# Altium project US_SB_HW.PrjPcb
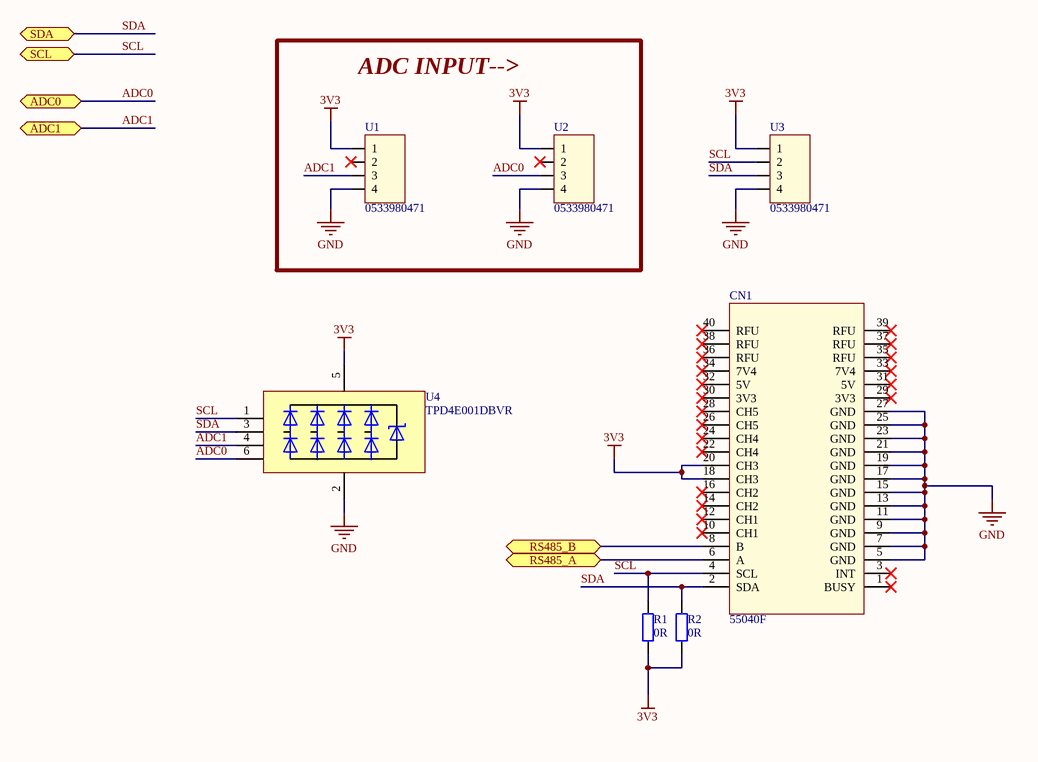
[diagram p0: US_SB_BIC.SchDoc]
hwver: v0.2
9 sheets, 131 parts. Net scope: hierarchical (ports join the sheet entries above them; power ports are global).
Board file: US_SB_GHW.PcbDoc
Sheets:
  US_SB_BIC.SchDoc
  US_SB_GC.SchDoc
  US_SB_GHW.SchDoc
  US_SB_MCU.SchDoc
  US_SB_Meteo.SchDoc
  US_SB_Orinet.SchDoc
  US_SB_OS.SchDoc
  US_SB_RS485.SchDoc
  US_SB_USB.SchDoc

## Sheet US_SB_BIC.SchDoc
size A4

### Parts
CN1  55040F  [HEADER_40PIN_12MM2]
R1  0R  [R0603_IPC_MD]  (no BOM)
R2  0R  [R0603_IPC_MD]  (no BOM)
U1  0533980471  [PB_53261-0471_Right]
U2  0533980471  [PB_53261-0471_Right]
U3  0533980471  [PB_53261-0471_Right]
U4  TPD4E001DBVR  [SOT23-6]

### Blocks framed on the sheet
ADC INPUT-->: U1 U2

### Ports
ADC0, ADC1, RS485_A (bidir), RS485_B (bidir), SCL, SDA

### Nets
3V3: CN1.18(CH3) CN1.20(CH3) R1.1 R2.1 U1.1 U2.1 U3.1 U4.5(VCC)
GND: CN1.5(GND) CN1.7(GND) CN1.9(GND) CN1.11(GND) CN1.13(GND) CN1.15(GND) CN1.17(GND) CN1.19(GND) CN1.21(GND) CN1.23(GND) CN1.25(GND) CN1.27(GND) U1.4 U2.4 U3.4 U4.2(GND)
ADC0: U2.3 U4.6(IO4) ; port ADC0
ADC1: U1.3 U4.4(IO3) ; port ADC1
SCL: CN1.4(SCL) R1.2 U3.2 U4.1(IO1) ; port SCL
SDA: CN1.2(SDA) R2.2 U3.3 U4.3(IO2) ; port SDA
NetCN1_6: CN1.6(A) ; port RS485_A
NetCN1_8: CN1.8(B) ; port RS485_B

Not connected (* = marked no-connect by the designer): CN1 1(BUSY)* 3(INT)* 10(CH1)* 12(CH1)* 14(CH2)* 16(CH2)* 22(CH4)* 24(CH4)* 26(CH5)* 28(CH5)* 29(3V3)* 30(3V3)* 31(5V)* 32(5V)* 33(7V4)* 34(7V4)* 35(RFU)* 36(RFU)* 37(RFU)* 38(RFU)* 39(RFU)* 40(RFU)*; U1 2*; U2 2*

### Library data of the parts
CN1 = ALFASAT_BIC: CONN HEADER R/A 40POS 2.54MM; Manufacturer: On Shore Technology Inc.; Manufacturer Part Number: 55040F; Supplier 1: LCSC; Supplier Part Number 1: C35165
R1 R2 = CR0603-J/-000ELF: RES SMD 0 OHM JUMPER 1/10W 0603; Manufacturer: Bourns Inc.; Tolarance: 1%; Value: 0R; Manufacturer Part Number: CR0603-J/-000ELF; Supplier 1: Digi-Key; Supplier Part Number 1: CR0603-J/-000ELFCT-ND
U1-U3 = PB_053398_0471: Connector Header Surface Mount 4 position 0.049" (1.25mm); Manufacturer: Molex; Manufacturer Part Number: 0533980471; Supplier 1: Digi-Key; Supplier Part Number 1: WM7608TR-ND
U4 = TPD4E001DBVR: 4x TVS DIODE 5.5V SOT23-6; Manufacturer: TI; Manufacturer Part Number: TPD4E001DBVR; Supplier 1: Digi-Key; Supplier Part Number 1: 296-28203-1-ND

## Sheet US_SB_GC.SchDoc
size A4
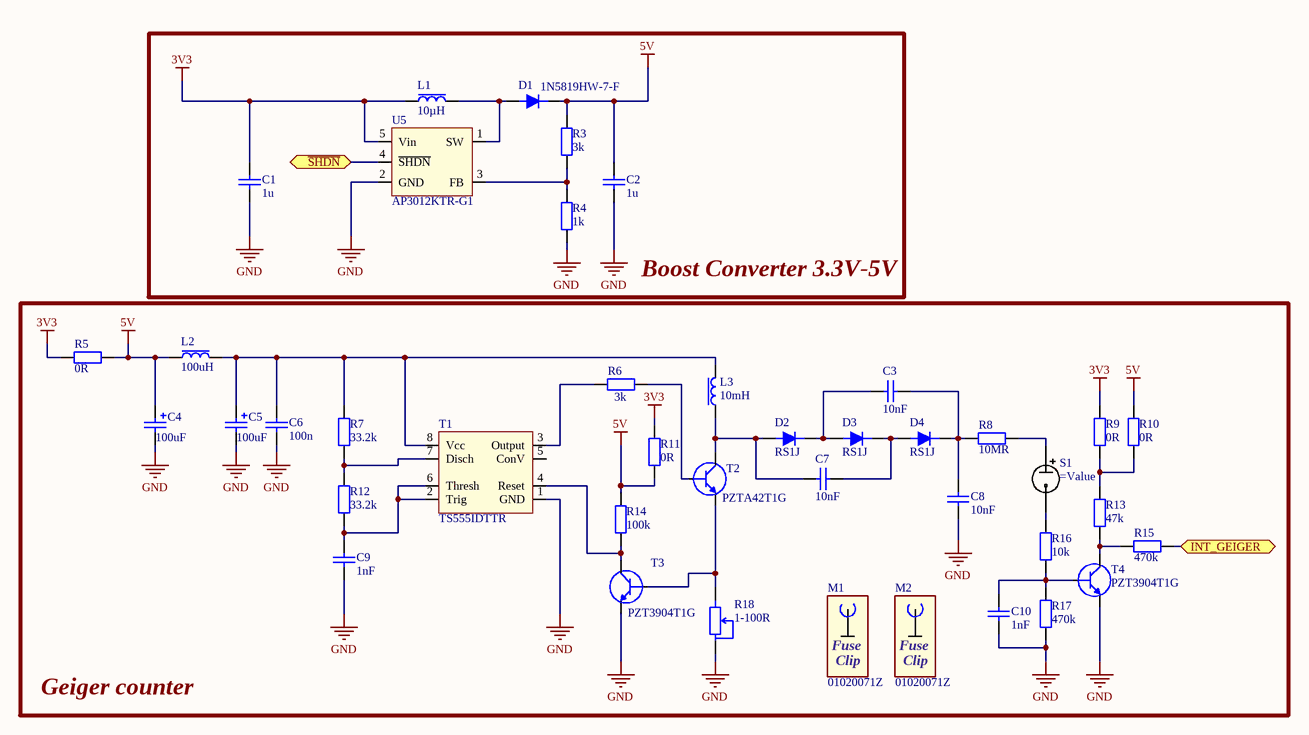
[diagram p1: US_SB_GC.SchDoc]

### Parts
C1  1u  [C0603_IPC_HD]
C2  1u  [C0603_IPC_HD]
C3  10nF  [Chip2Pin1206_10n]
C4  100uF  [CAPAE7866X77_100uF16V]
C5  100uF  [CAPAE7866X77_100uF16V]
C6  100n  [C0603_IPC_HD]
C7  10nF  [Chip2Pin1206_10n]
C8  10nF  [Chip2Pin1206_10n]
C9  1nF  [C0603_IPC_MD]
C10  1nF  [C0603_IPC_MD]
D1  1N5819HW-7-F  [1N5819HW_SODFL370X135-2N]
D2  RS1J  [RS1J-DFN]
D3  RS1J  [RS1J-DFN]
D4  RS1J  [RS1J-DFN]
L1  10µH  [NRH3012T100MN]
L2  100uH  [IND100uH_4040X18N]
L3  10mH  [IND10mH_12.7X12.7]
M1  01020071Z  (mechanical)
M2  01020071Z  (mechanical)
R3  3k  [C0603_IPC_HD]
R4  1k  [R0603_IPC_MD]
R5  0R  [R0603_IPC_MD]
R6  3k  [C0603_IPC_HD]
R7  33.2k  [R0603_IPC_MD]
R8  10MR  [C1206_IPC_MD]
R9  0R  [R0603_IPC_MD]
R10  0R  [R0603_IPC_MD]  (no BOM)
R11  0R  [R0603_IPC_MD]
R12  33.2k  [R0603_IPC_MD]
R13  47k  [R0603_IPC_HD]
R14  100k  [R0603_IPC_MD]
R15  470k  [C0603_IPC_HD]
R16  10k  [C1206_IPC_HD]
R17  470k  [C0603_IPC_HD]
R18  1-100R  [3296W_POT]
S1  (no value)  [SI-3BG]
T1  TS555IDTTR  [SOIC127P600X175-(TS555)]
T2  PZTA42T1G  [PZTA42T1G_SOT230P]
T3  PZT3904T1G  [PZT3904_SOT223]
T4  PZT3904T1G  [PZT3904_SOT223]
U5  AP3012KTR-G1  [AP3012_SOT95P280X145-5N]

### Blocks framed on the sheet
Boost Converter 3.3V-5V: C1 C2 D1 L1 R3 R4 U5
Geiger counter: C3-C10 D2-D4 L2 L3 M1 M2 R5-R18 S1 T1-T4

### Ports
INT_GEIGER, ~{SHDN}

### Nets
3V3: C1.2 L1.1 R5.1 R9.2 R11.2 U5.5(Vin)
5V: C2.2 C4.1 D1.2 L2.1 R3.2 R5.2 R10.2 R11.1 R14.2
GND: C1.1 C2.1 C4.2 C5.2 C6.2 C8.1 C9.1 C10.1 R4.1 R17.1 R18.2 T1.1(GND) T3.3(E) T4.3(E) U5.2(GND)
NetC3_1: C3.1 D2.2 D3.1
NetC3_2: C3.2 C8.2 D4.2 R8.1
NetC5_1: C5.1 C6.1 L2.2 L3.2 R7.2 T1.8(Vcc)
NetC7_1: C7.1 D2.1 L3.1 T2.2(C)
NetC7_2: C7.2 D3.2 D4.1
NetC9_2: C9.2 R12.1 T1.2(Trig) T1.6(Thresh)
NetC10_2: C10.2 R16.1 R17.2 T4.1(B)
NetD1_1: D1.1 L1.2 U5.1(SW)
NetR3_1: R3.1 R4.2 U5.3(FB)
NetR6_1: R6.1 T1.3(Output)
NetR6_2: R6.2 T2.1(B)
NetR7_1: R7.1 R12.2 T1.7(Disch)
NetR8_2: R8.2 S1.1
NetR9_1: R9.1 R10.1 R13.2
NetR13_1: R13.1 R15.1 T4.2(C)
NetR14_1: R14.1 T1.4(Reset) T3.2(C)
NetR15_2: R15.2 ; port INT_GEIGER
NetR16_2: R16.2 S1.2
NetR18_1: R18.1 T2.3(E) T3.1(B)
NetU5_4: U5.4(~{SHDN}) ; port ~{SHDN}

Not connected (* = marked no-connect by the designer): T1 5(ConV)

### Notes on the sheet
- (in symbol FUSE_CLIP) Fuse; Clip

### Library data of the parts
C1 C2 = CL10B105MO8NNWC: CAP CER 1UF 16V X7R 0603; Manufacturer: Samsung Electro-Mechanics; Manufacturer Part Number: CL10B105MO8NNWC; Voltage: 16V; Value: 1u; Dielectric: X7R; Supplier 1: Digi-Key; Supplier Part Number 1: 1276-6524-1-ND
C3 C7 C8 = CL1206_10nF_1000V: CAP CER 10000PF 1000V X7R 1206; Manufacturer: Wurth Electronics Inc.; Manufacturer Part Number: 885342208021; Voltage: 1000V; Value: 10nF; Dielectric: X7R; Supplier 1: Digi-Key; Supplier Part Number 1: 732-12078-1-ND
C4 C5 = CP100uF_16V: CAP ALUM 100UF 20% 16V SMD; Manufacturer: Panasonic Electronic Components; Manufacturer Part Number: EEE-HC1C101XP; Dielectric: X7R; Voltage: 16V; Value: 100uF; Supplier 1: Digi-Key; Supplier Part Number 1: PCE3750CT-ND
C6 = CL10B104KO8NNNC: CAP CER 0.1UF 16V X7R 0603; Manufacturer: Samsung Electro-Mechanics; Manufacturer Part Number: CL10B104KO8NNNC; Voltage: 16V; Value: 100n; Dielectric: X7R; Supplier 1: Digi-Key; Supplier Part Number 1: 1276-1005-1-ND
C9 C10 = CL0603_1nF_0603: CAP CER 1000PF 50V X7R 0603; Manufacturer: Samsung Electro-Mechanics; Manufacturer Part Number: CL10B102KB8NNNC; Voltage: 50V; Value: 1nF; Dielectric: X7R; Supplier 1: Digi-Key; Supplier Part Number 1: 1276-1018-1-ND
D1 = 1N5819HW: DIODE SCHOTTKY 40V 1A SOD123; Manufacturer: Diodes Incorporated; Manufacturer Part Number: 1N5819HW-7-F; Voltage - DC Reverse (Vr) (Max): 40V; Supplier 1: Digi-Key; Supplier Part Number 1: 1N5819HW-FDICT-ND; Current - Average Rectified (Io): 1A
D2-D4 = RS1A-M: DIODE GEN PURP 600V 1A SMA; Manufacturer: ON Semiconductor; Reverse Recovery Time (trr): 250ns; Manufacturer Part Number: RS1J; Voltage - DC Reverse (Vr) (Max): 600V; Supplier 1: Digi-Key; Supplier Part Number 1: RS1JFSCT-ND; Current - Average Rectified (Io): 1A
L1 = 10uH_Inductor_720mA: 10µH Shielded Wirewound Inductor 720mA 324mOhm Max Nonstandard; Manufacturer: Taiyo Yuden; Manufacturer Part Number: NRH3012T100MN; Value: 10µH; Supplier 1: Digi-Key; Supplier Part Number 1: 587-2584-1-ND
L2 = 100UH.Inductor 280mA: 100µH Inductor 280mA 1.74 Ohm Max Nonstandard; Manufacturer: Taiyo Yuden; Manufacturer Part Number: NRS4018T101MDGJ; Value: 100uH; Supplier 1: Digi-Key; Supplier Part Number 1: 587-6091-1-ND
L3 = 10mH Inductor 180mA: 10mH Shielded Wirewound Inductor 180mA 19.2 Ohm Max Nonstandard; Manufacturer: Bourns Inc.; Manufacturer Part Number: SRR1208-103KL; Value: 10mH; Supplier 1: Digi-Key; Supplier Part Number 1: SRR1208-103KLCT-ND
M1 M2 = FUSE_CLIP: FUSE CLIP; Manufacturer: Littelfuse Inc.; Manufacturer Part Number: 01020071Z; Supplier 1: Digi-Key; Supplier Part Number 1: F3781-ND
R3 R6 = CR0603-JW-3k: RES SMD 3K OHM 5% 1/10W 0603; Manufacturer: Bourns Inc.; Manufacturer Part Number: CR0603-JW-302ELF; Value: 3k; Tolarance: ±5%; Supplier 1: Digi-Key; Supplier Part Number 1: CR0603-JW-302ELFCT-ND
R4 = CR0603-JW-102ELF: RES SMD 1K OHM 5% 1/10W 0603; Manufacturer: Bourns Inc.; Value: 1k; Tolarance: 5%; Manufacturer Part Number: CR0603-JW-102ELF; Supplier 1: Digi-Key; Supplier Part Number 1: CR0603-JW-102ELFCT-ND
R5 R9-R11 = CR0603-J/-000ELF: as R1 on sheet US_SB_BIC; Value: 0R; Manufacturer Part Number: CR0603-J/-000ELF; Supplier 1: Digi-Key; Supplier Part Number 1: CR0603-J/-000ELFCT-ND
R7 R12 = RMCF0603FT33K2: RES 33.2K OHM 1% 1/10W 0603; Manufacturer: Stackpole Electronics Inc; Value: 33.2k; Tolarance: 1%; Manufacturer Part Number: RMCF0603FT33K2; Supplier 1: Digi-Key; Supplier Part Number 1: RMCF0603FT33K2CT-ND
R8 = CR1206-JW-10MOm: RES SMD 10M OHM 5% 1/4W 1206; Manufacturer: Bourns Inc.; Manufacturer Part Number: CR1206-JW-106ELF; Value: 10MR; Tolarance: ±5%; Supplier 1: Digi-Key; Supplier Part Number 1: CR1206-JW-106ELFCT-ND
R13 = CR0603-JW-473ELF: RES SMD 47K OHM 5% 1/10W 0603; Manufacturer: Bourns Inc.; Value: 47k; Tolarance: 5%; Manufacturer Part Number: CR0603-JW-473ELF; Supplier 1: Digi-Key; Supplier Part Number 1: CR0603-JW-473ELFCT-ND
R14 = CR0603-JW-104ELF: RES 100K OHM 1% 1/10W 0603; Manufacturer: Stackpole Electronics Inc; Manufacturer Part Number: RMCF0603FT100K; Value: 100k; Tolarance: ±1%; Supplier 1: Digi-Key; Supplier Part Number 1: RMCF0603FT100KCT-ND
R15 R17 = CR0603-JW-470k: RES SMD 470K OHM 5% 1/10W 0603; Manufacturer: Bourns Inc.; Manufacturer Part Number: CR0603-JW-474ELF; Value: 470k; Tolarance: ±5%; Supplier 1: Digi-Key; Supplier Part Number 1: CR0603-JW-474ELFCT-ND
R16 = CR1206-JW-10k: RES SMD 10K OHM 5% 1/4W 1206; Manufacturer: Bourns Inc.; Manufacturer Part Number: CR1206-JW-103ELF; Value: 10k; Tolarance: ±5%; Supplier 1: Digi-Key; Supplier Part Number 1: CR1206-JW-103ELFCT-ND
R18 = 3296W-1-101R: 100 ±10% ±250ppm/℃ 3296W Precision Potentiometer RoH; Manufacturer: Chengdu Guosheng Tech; Value: 1-100R; Tolarance: 10%; Manufacturer Part Number: 3296W-1-101; Supplier 1: LCSC; Supplier Part Number 1: C118961
S1 = GEIGER TUBE: FUSE CLIP CARTRIDGE PCB (FOR GEIGER TUBE); Manufacturer: USSR; Manufacturer Part Number: SI-3BG; Supplier 1: Kharkiv; Supplier Part Number 1: SI-3BG
T1 = TS555: 555 Type, Timer/Oscillator (Single) IC 2.7MHz 8-SO; Manufacturer: STMicroelectronics; Manufacturer Part Number: TS555IDTTR; Supplier 1: Digi-Key; Supplier Part Number 1: 497-16404-1-ND
T2 = PZTA42T1(MPSA42 ): Bipolar (BJT) Transistor NPN 300V 500mA 50MHz 1.5W Surface Mount SOT-223; Manufacturer: ON Semiconductor; Current - Collector (Ic) (Max): 500mA; Voltage - Collector Emitter Breakdown (Max): 300V; Manufacturer Part Number: PZTA42T1G; Supplier 1: Digi-Key; Supplier Part Number 1: PZTA42T1GOSCT-ND
T3 T4 = PZT3904(2N3904): Bipolar (BJT) Transistor NPN 40V 200mA 300MHz 1.5W Surface Mount SOT-223; Manufacturer: ON Semiconductor; Current - Collector (Ic) (Max): 200mA; Voltage - Collector Emitter Breakdown (Max): 40V; Manufacturer Part Number: PZT3904T1G; Supplier 1: Digi-Key; Supplier Part Number 1: PZT3904T1GOSCT-ND
U5 = AP3012KTR: Boost Switching Regulator IC Positive Adjustable 1.25V 1 Output 500mA (Switch) SC-74A, SOT-753; Manufacturer: Diodes Incorporated; Manufacturer Part Number: AP3012KTR-G1; Supplier 1: Digi-Key; Supplier Part Number 1: AP3012KTR-G1DICT-ND

## Sheet US_SB_GHW.SchDoc
size A4
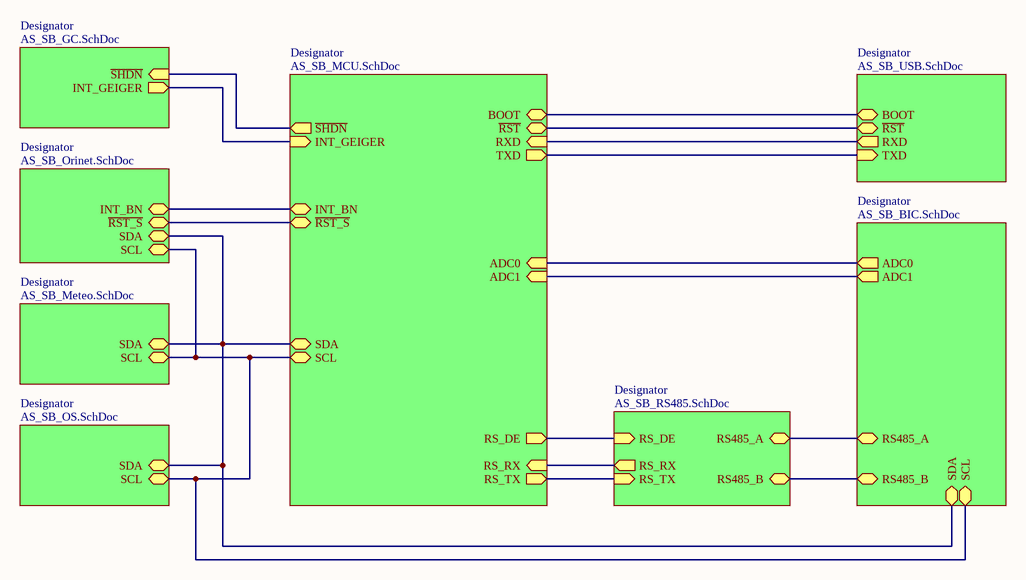
[diagram p2: US_SB_GHW.SchDoc]

### Sub-sheets
Designator = AS_SB_MCU.SchDoc (file not in this document): INT_BN, ~{SHDN} (out), INT_GEIGER (in), RS_DE (out), RS_RX (in), RS_TX (out), ADC1 (in), ADC0 (in), RXD (in), TXD (out), SDA (bidir), SCL (bidir), ~{RST}, BOOT, ~{RST_S}
Designator = AS_SB_USB.SchDoc (file not in this document): RXD (out), TXD (in), ~{RST}, BOOT
Designator = AS_SB_Orinet.SchDoc (file not in this document): SDA (bidir), SCL (bidir), INT_BN, ~{RST_S}
Designator = AS_SB_Meteo.SchDoc (file not in this document): SDA (bidir), SCL (bidir)
Designator = AS_SB_OS.SchDoc (file not in this document): SDA (bidir), SCL (bidir)
Designator = AS_SB_GC.SchDoc (file not in this document): ~{SHDN} (in), INT_GEIGER (out)
Designator = AS_SB_RS485.SchDoc (file not in this document): RS_DE (in), RS_RX (out), RS_TX (in), RS485_A, RS485_B
Designator = AS_SB_BIC.SchDoc (file not in this document): RS485_A, RS485_B, SCL (bidir), SDA (bidir), ADC1 (out), ADC0 (out)

### Nets
(unnamed): sheet Designator/INT_BN, sheet Designator/INT_BN
(unnamed): sheet Designator/~{SHDN}, sheet Designator/~{SHDN}
(unnamed): sheet Designator/INT_GEIGER, sheet Designator/INT_GEIGER
(unnamed): sheet Designator/RS_DE, sheet Designator/RS_DE
(unnamed): sheet Designator/RS_RX, sheet Designator/RS_RX
(unnamed): sheet Designator/RS_TX, sheet Designator/RS_TX
(unnamed): sheet Designator/ADC1, sheet Designator/ADC1
(unnamed): sheet Designator/ADC0, sheet Designator/ADC0
(unnamed): sheet Designator/RXD, sheet Designator/RXD
(unnamed): sheet Designator/TXD, sheet Designator/TXD
(unnamed): sheet Designator/SDA, sheet Designator/SDA, sheet Designator/SDA, sheet Designator/SDA, sheet Designator/SDA
(unnamed): sheet Designator/SCL, sheet Designator/SCL, sheet Designator/SCL, sheet Designator/SCL, sheet Designator/SCL
(unnamed): sheet Designator/~{RST}, sheet Designator/~{RST}
(unnamed): sheet Designator/BOOT, sheet Designator/BOOT
(unnamed): sheet Designator/~{RST_S}, sheet Designator/~{RST_S}
(unnamed): sheet Designator/RS485_A, sheet Designator/RS485_A
(unnamed): sheet Designator/RS485_B, sheet Designator/RS485_B

## Sheet US_SB_MCU.SchDoc
size A2
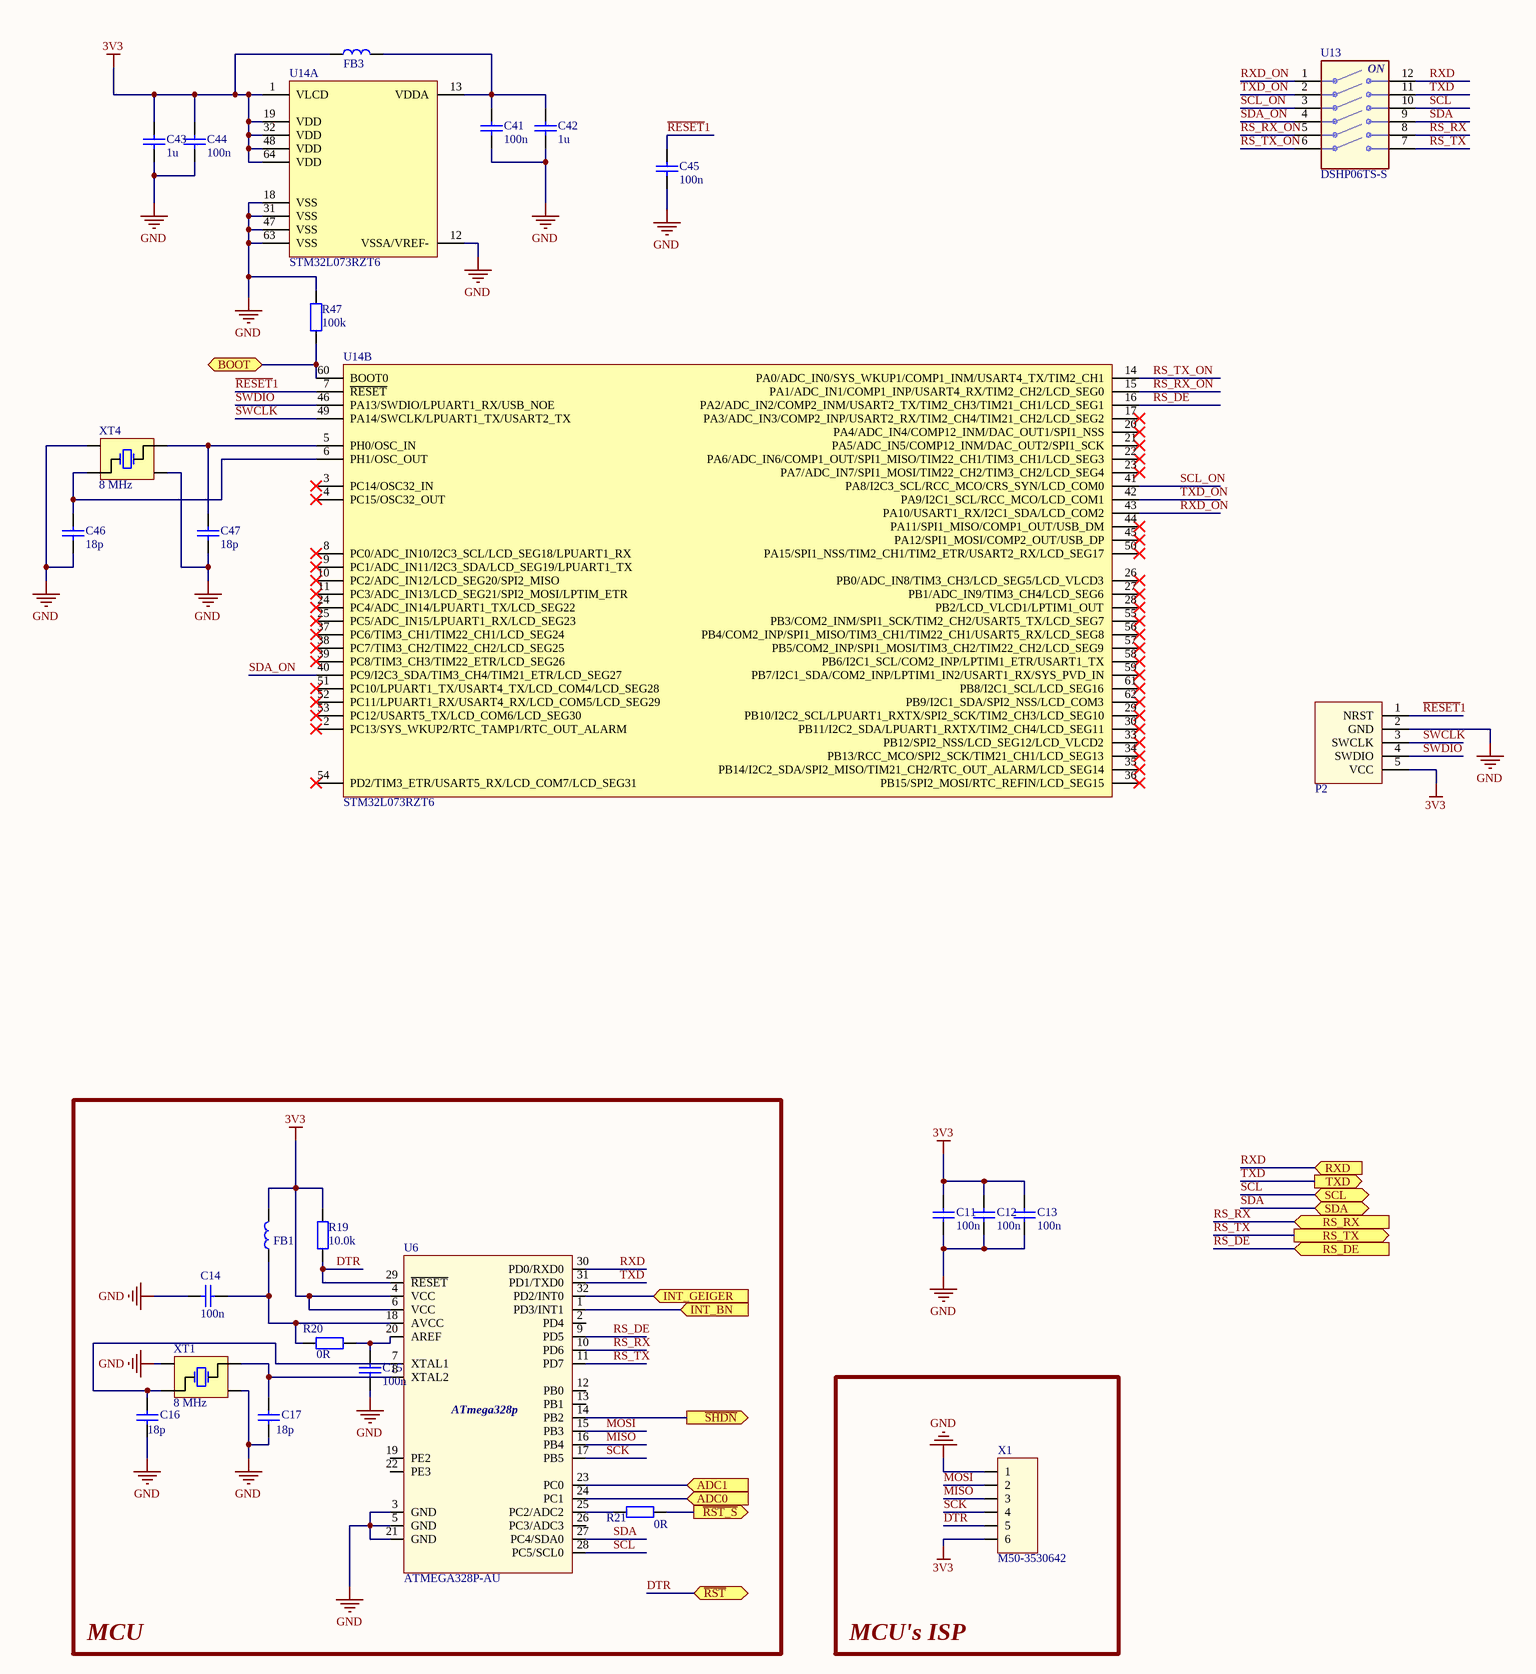
[diagram p3: US_SB_MCU.SchDoc]

### Parts
C11  100n  [C0603_IPC_HD]
C12  100n  [C0603_IPC_HD]
C13  100n  [C0603_IPC_HD]
C14  100n  [C0603_IPC_HD]
C15  100n  [C0603_IPC_HD]
C16  18p  [C0603_IPC_HD]
C17  18p  [C0603_IPC_HD]
C41  100n  [C0603_IPC_HD]
C42  1u  [C0603_IPC_HD]
C43  1u  [C0603_IPC_HD]
C44  100n  [C0603_IPC_HD]
C45  100n  [C0603_IPC_HD]
C46  18p  [C0603_IPC_HD]
C47  18p  [C0603_IPC_HD]
FB1  MH1608-601Y  [L0603_IPC_MD]  (value not drawn)
FB3  MH1608-601Y  [L0603_IPC_MD]  (value not drawn)
P2  SWD  [SWD_CON_VAR1]  (value not drawn)  (no BOM)
R19  10.0k  [R0603_IPC_MD]
R20  0R  [R0603_IPC_MD]
R21  0R  [R0603_IPC_MD]  (no BOM)
R47  100k  [R0603_IPC_MD]
U6  ATMEGA328P-AU  [ATmega328P_TQFP80P900X900X120-32N]
U13  DSHP06TS-S  [SOIC_SW_SOIC127P850X235-12N]
U14  STM32L073RZT6  [LQFP64_10X10MM]  (parts A,B of 2)
X1  M50-3530642  [PLS_1X6_1.27]  (no BOM)
XT1  8 MHz  [5.0X3.2_4PAD_SMT]
XT4  8 MHz  [5.0X3.2_4PAD_SMT]

### Blocks framed on the sheet
MCU: C14-C17 FB1 R19-R21 U6 XT1
MCU's ISP: X1

### Ports
ADC0 (in), ADC1 (in), BOOT, INT_BN (in), INT_GEIGER (in), RS_DE (in), RS_RX (in), RS_TX (out), RXD (in), SCL, SDA, TXD (out), ~{RST_S} (out), ~{RST}, ~{SHDN} (out)

### Nets
3V3: C11.1 C12.1 C13.1 C43.2 C44.2 FB1.2 FB3.1 P2.5(VCC) R19.2 U6.4(VCC) U6.6(VCC) U14.1(VLCD) U14.19(VDD) U14.32(VDD) U14.48(VDD) U14.64(VDD) X1.6
GND: C11.2 C12.2 C13.2 C14.2 C15.2 C16.1 C17.1 C41.1 C42.1 C43.1 C44.1 C45.2 C46.1 C47.1 P2.2(GND) R47.2 U6.3(GND) U6.5(GND) U6.21(GND) U14.12(VSSA/VREF-) U14.18(VSS) U14.31(VSS) U14.47(VSS) U14.63(VSS) X1.1 XT1.2(NC) XT1.4(NC) XT4.2(NC) XT4.4(NC)
~{RESET}1: C45.1 P2.1(NRST) U14.7(~{RESET})
DTR: R19.1 U6.29(~{RESET}) X1.5 ; port ~{RST}
MISO: U6.16(PB4) X1.3
MOSI: U6.15(PB3) X1.2
RS_DE: U6.9(PD5) U14.16(PA2/ADC_IN2/COMP2_INM/USART2_TX/TIM2_CH3/TIM21_CH1/LCD_SEG1) ; port RS_DE
RS_RX: U6.10(PD6) U13.8 ; port RS_RX
RS_RX_ON: U13.5 U14.15(PA1/ADC_IN1/COMP1_INP/USART4_RX/TIM2_CH2/LCD_SEG0)
RS_TX: U6.11(PD7) U13.7 ; port RS_TX
RS_TX_ON: U13.6 U14.14(PA0/ADC_IN0/SYS_WKUP1/COMP1_INM/USART4_TX/TIM2_CH1)
RXD: U6.30(PD0/RXD0) U13.12 ; port RXD
RXD_ON: U13.1 U14.43(PA10/USART1_RX/I2C1_SDA/LCD_COM2)
SCK: U6.17(PB5) X1.4
SCL: U6.28(PC5/SCL0) U13.10 ; port SCL
SCL_ON: U13.3 U14.41(PA8/I2C3_SCL/RCC_MCO/CRS_SYN/LCD_COM0)
SDA: U6.27(PC4/SDA0) U13.9 ; port SDA
SDA_ON: U13.4 U14.40(PC9/I2C3_SDA/TIM3_CH4/TIM21_ETR/LCD_SEG27)
SWCLK: P2.3(SWCLK) U14.49(PA14/SWCLK/LPUART1_TX/USART2_TX)
SWDIO: P2.4(SWDIO) U14.46(PA13/SWDIO/LPUART1_RX/USB_NOE)
TXD: U6.31(PD1/TXD0) U13.11 ; port TXD
TXD_ON: U13.2 U14.42(PA9/I2C1_SCL/RCC_MCO/LCD_COM1)
NetC14_1: C14.1 FB1.1 R20.1 U6.18(AVCC)
NetC15_1: C15.1 R20.2 U6.20(AREF)
NetC16_2: C16.2 U6.7(XTAL1) XT1.3(OSC2)
NetC17_2: C17.2 U6.8(XTAL2) XT1.1(OSC1)
NetC41_2: C41.2 C42.2 FB3.2 U14.13(VDDA)
NetC46_2: C46.2 U14.6(PH1/OSC_OUT) XT4.3(OSC2)
NetC47_2: C47.2 U14.5(PH0/OSC_IN) XT4.1(OSC1)
NetR21_1: R21.1 U6.25(PC2/ADC2)
NetR21_2: R21.2 ; port ~{RST_S}
NetR47_1: R47.1 U14.60(BOOT0) ; port BOOT
NetU6_1: U6.1(PD3/INT1) ; port INT_BN
NetU6_14: U6.14(PB2) ; port ~{SHDN}
NetU6_23: U6.23(PC0) ; port ADC1
NetU6_24: U6.24(PC1) ; port ADC0
NetU6_32: U6.32(PD2/INT0) ; port INT_GEIGER

Not connected (* = marked no-connect by the designer): U6 2(PD4) 12(PB0) 13(PB1) 19(PE2) 22(PE3) 26(PC3/ADC3); U14 2(PC13/SYS_WKUP2/RTC_TAMP1/RTC_OUT_ALARM)* 3(PC14/OSC32_IN)* 4(PC15/OSC32_OUT)* 8(PC0/ADC_IN10/I2C3_SCL/LCD_SEG18/LPUART1_RX)* 9(PC1/ADC_IN11/I2C3_SDA/LCD_SEG19/LPUART1_TX)* 10(PC2/ADC_IN12/LCD_SEG20/SPI2_MISO)* 11(PC3/ADC_IN13/LCD_SEG21/SPI2_MOSI/LPTIM_ETR)* 17(PA3/ADC_IN3/COMP2_INP/USART2_RX/TIM2_CH4/TIM21_CH2/LCD_SEG2)* 20(PA4/ADC_IN4/COMP12_INM/DAC_OUT1/SPI1_NSS)* 21(PA5/ADC_IN5/COMP12_INM/DAC_OUT2/SPI1_SCK)* 22(PA6/ADC_IN6/COMP1_OUT/SPI1_MISO/TIM22_CH1/TIM3_CH1/LCD_SEG3)* 23(PA7/ADC_IN7/SPI1_MOSI/TIM22_CH2/TIM3_CH2/LCD_SEG4)* 24(PC4/ADC_IN14/LPUART1_TX/LCD_SEG22)* 25(PC5/ADC_IN15/LPUART1_RX/LCD_SEG23)* 26(PB0/ADC_IN8/TIM3_CH3/LCD_SEG5/LCD_VLCD3)* 27(PB1/ADC_IN9/TIM3_CH4/LCD_SEG6)* 28(PB2/LCD_VLCD1/LPTIM1_OUT)* 29(PB10/I2C2_SCL/LPUART1_RXTX/SPI2_SCK/TIM2_CH3/LCD_SEG10)* 30(PB11/I2C2_SDA/LPUART1_RXTX/TIM2_CH4/LCD_SEG11)* 33(PB12/SPI2_NSS/LCD_SEG12/LCD_VLCD2)* 34(PB13/RCC_MCO/SPI2_SCK/TIM21_CH1/LCD_SEG13)* 35(PB14/I2C2_SDA/SPI2_MISO/TIM21_CH2/RTC_OUT_ALARM/LCD_SEG14)* 36(PB15/SPI2_MOSI/RTC_REFIN/LCD_SEG15)* 37(PC6/TIM3_CH1/TIM22_CH1/LCD_SEG24)* 38(PC7/TIM3_CH2/TIM22_CH2/LCD_SEG25)* 39(PC8/TIM3_CH3/TIM22_ETR/LCD_SEG26)* 44(PA11/SPI1_MISO/COMP1_OUT/USB_DM)* 45(PA12/SPI1_MOSI/COMP2_OUT/USB_DP)* 50(PA15/SPI1_NSS/TIM2_CH1/TIM2_ETR/USART2_RX/LCD_SEG17)* 51(PC10/LPUART1_TX/USART4_TX/LCD_COM4/LCD_SEG28)* 52(PC11/LPUART1_RX/USART4_RX/LCD_COM5/LCD_SEG29)* 53(PC12/USART5_TX/LCD_COM6/LCD_SEG30)* 54(PD2/TIM3_ETR/USART5_RX/LCD_COM7/LCD_SEG31)* 55(PB3/COM2_INM/SPI1_SCK/TIM2_CH2/USART5_TX/LCD_SEG7)* 56(PB4/COM2_INP/SPI1_MISO/TIM3_CH1/TIM22_CH1/USART5_RX/LCD_SEG8)* 57(PB5/COM2_INP/SPI1_MOSI/TIM3_CH2/TIM22_CH2/LCD_SEG9)* 58(PB6/I2C1_SCL/COM2_INP/LPTIM1_ETR/USART1_TX)* 59(PB7/I2C1_SDA/COM2_INP/LPTIM1_IN2/USART1_RX/SYS_PVD_IN)* 61(PB8/I2C1_SCL/LCD_SEG16)* 62(PB9/I2C1_SDA/SPI2_NSS/LCD_COM3)*

### Notes on the sheet
- (in symbol ATMEGA328P-AU) ATmega328p
- (in symbol DSHP06TS-S) ON

### Library data of the parts
C11-C15 C41 C44 C45 = CL10B104KO8NNNC: as C6 on sheet US_SB_GC; Manufacturer Part Number: CL10B104KO8NNNC; Voltage: 16V; Value: 100n; Dielectric: X7R; Supplier 1: Digi-Key; Supplier Part Number 1: 1276-1005-1-ND
C16 C17 C46 C47 = CL10C180JB8NNNC: CAP CER 18PF 50V C0G/NP0 0603; Manufacturer: Samsung Electro-Mechanics; Manufacturer Part Number: CL10C180JB8NNNC; Voltage: 50V; Value: 18p; Dielectric: C0G/NP0; Supplier 1: Digi-Key; Supplier Part Number 1: 1276-1089-1-ND
C42 C43 = CL10B105MO8NNWC: as C1 on sheet US_SB_GC; Manufacturer Part Number: CL10B105MO8NNWC; Voltage: 16V; Value: 1u; Dielectric: X7R; Supplier 1: Digi-Key; Supplier Part Number 1: 1276-6524-1-ND
FB1 FB3 = MH1608-601Y: FERRITE BEAD 600R@100MHz 0603 for Power Line, 1000mA; Manufacturer: Bourns Inc.; Manufacturer Part Number: MH1608-601Y; Supplier 1: Digi-Key; Supplier Part Number 1: MH1608-601YCT-ND
P2 = SWD-CONNECTOR_VAR1: SWDIO SWCLK VDD GND NRST; Manufacturer: *; Manufacturer Part Number: *; Supplier 1: *; Supplier Part Number 1: *
R19 = RMCF0603FT10K0: RES 10K OHM 1% 1/10W 0603; Manufacturer: Stackpole Electronics Inc; Value: 10.0k; Tolarance: 1%; Manufacturer Part Number: RMCF0603FT10K0; Supplier 1: Digi-Key; Supplier Part Number 1: RMCF0603FT10K0CT-ND
R20 R21 = CR0603-J/-000ELF: as R1 on sheet US_SB_BIC; Value: 0R; Manufacturer Part Number: CR0603-J/-000ELF; Supplier 1: Digi-Key; Supplier Part Number 1: CR0603-J/-000ELFCT-ND
R47 = CR0603-JW-104ELF: RES SMD 100K OHM 5% 1/10W 0603; Manufacturer: Bourns Inc.; Value: 100k; Tolarance: 5%; Manufacturer Part Number: CR0603-JW-104ELF; Supplier 1: Digi-Key; Supplier Part Number 1: CR0603-JW-104ELFCT-ND
U6 = ATMEGA328P-AU: AVR AVR® ATmega Microcontroller IC 8-Bit 20MHz 32KB (16K x 16) FLASH 32-TQFP (7x7); Manufacturer: Microchip Technology; SRAM: 2K x 8; Manufacturer Part Number: ATMEGA328P-AU; FLASH: 32KB (16K x 16); Supplier 1: Digi-Key; Supplier Part Number 1: ATMEGA328P-AU-ND
U13 = DSHP06TS-S: SPST 6 1.27mm, Half Slide (Standard) Black SMD DIP Switches RoHS; Manufacturer: XKB Enterprise; Manufacturer Part Number: DSHP06TS-S; Supplier 1: lcsc.com; Supplier Part Number 1: C319048
U14 = STM32L073RZT6: Ultra-low-power 32-bit MCU ARM®-based Cortex®-M0+; Manufacturer: ST; SRAM: 20KB; FLASH: 192KB; Manufacturer Part Number: STM32L073RZT6; Supplier 1: Digi-Key; Supplier Part Number 1: 497-16270-ND
X1 = PLD_1X6_1.27: CONN HEADER VERT 6POS 1.27MM; Manufacturer: Harwin Inc.; Number of Positions: 6; Manufacturer Part Number: M50-3530642; Supplier 1: Digi-Key; Supplier Part Number 1: 952-3602-ND
XT1 XT4 = ABM3B-8.000MHZ-10-1-U-T: 8MHz ±10ppm Crystal 10pF 200 Ohms 4-SMD, No Lead; Manufacturer: Abracon LLC; Manufacturer Part Number: ABM3B-8.000MHZ-10-1-U-T; Type: XTAL; Value: 8 MHz

## Sheet US_SB_Meteo.SchDoc
size A4
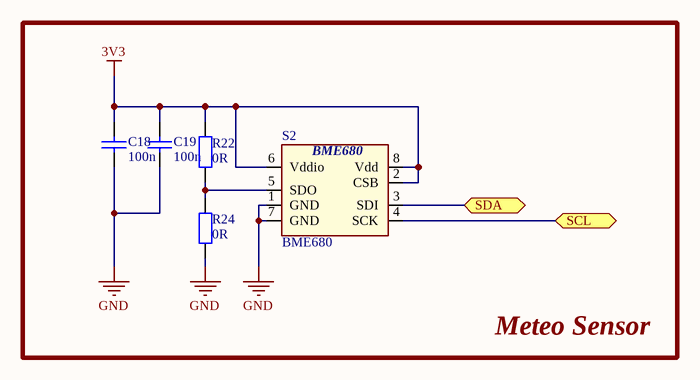
[diagram p4: US_SB_Meteo.SchDoc]

### Parts
C18  100n  [C0603_IPC_HD]
C19  100n  [C0603_IPC_HD]
R22  0R  [R0603_IPC_MD]  (no BOM)
R24  0R  [R0603_IPC_MD]
S2  BME680  [BME680]

### Blocks framed on the sheet
Meteo Sensor: C18 C19 R22 R24 S2

### Ports
SCL, SDA

### Nets
3V3: C18.2 C19.2 R22.2 S2.2(CSB) S2.6(Vddio) S2.8(Vdd)
GND: C18.1 C19.1 R24.1 S2.1(GND) S2.7(GND)
NetR22_1: R22.1 R24.2 S2.5(SDO)
NetS2_3: S2.3(SDI) ; port SDA
NetS2_4: S2.4(SCK) ; port SCL

### Library data of the parts
C18 C19 = CL10B104KO8NNNC: as C6 on sheet US_SB_GC; Manufacturer Part Number: CL10B104KO8NNNC; Voltage: 16V; Value: 100n; Dielectric: X7R; Supplier 1: Digi-Key; Supplier Part Number 1: 1276-1005-1-ND
R22 R24 = CR0603-J/-000ELF: as R1 on sheet US_SB_BIC; Value: 0R; Manufacturer Part Number: CR0603-J/-000ELF; Supplier 1: Digi-Key; Supplier Part Number 1: CR0603-J/-000ELFCT-ND
S2 = BME680: Gas, Humidity, Pressure, Temperature Sensor I²C, SPI Output; Manufacturer: Bosch Sensortec; Manufacturer Part Number: BME680; Supplier 1: Digi-Key; Supplier Part Number 1: 828-1077-1-ND

## Sheet US_SB_Orinet.SchDoc
size A4
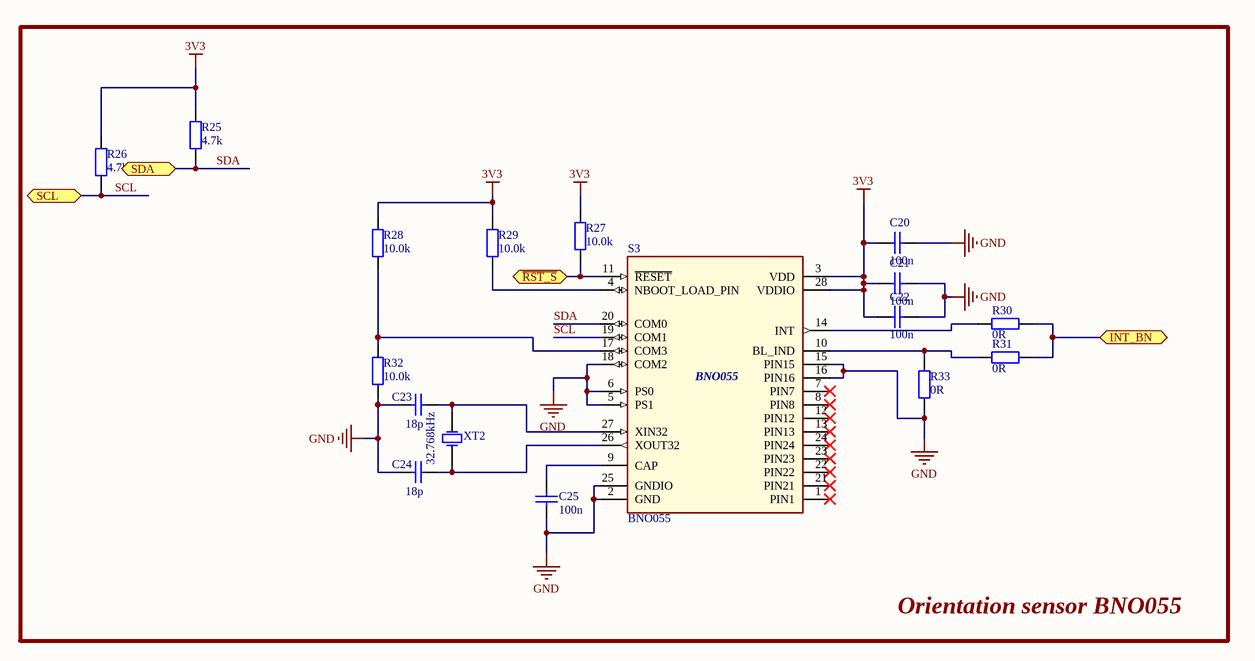
[diagram p5: US_SB_Orinet.SchDoc]

### Parts
C20  100n  [C0603_IPC_HD]
C21  100n  [C0603_IPC_HD]
C22  100n  [C0603_IPC_HD]
C23  18p  [C0603_IPC_HD]
C24  18p  [C0603_IPC_HD]
C25  100n  [C0603_IPC_HD]
R25  4.7k  [R0603_IPC_HD]
R26  4.7k  [R0603_IPC_HD]
R27  10.0k  [R0603_IPC_MD]
R28  10.0k  [R0603_IPC_MD]
R29  10.0k  [R0603_IPC_MD]
R30  0R  [R0603_IPC_MD]
R31  0R  [R0603_IPC_MD]  (no BOM)
R32  10.0k  [R0603_IPC_MD]
R33  0R  [R0603_IPC_MD]
S3  BNO055  [BNO055_LGA28R50P4X10_380X520X100]
XT2  32.768kHz  [FC-135R]

### Blocks framed on the sheet
Orientation sensor BNO055: C20-C25 R25-R33 S3 XT2

### Ports
INT_BN, SCL, SDA, ~{RST_S}

### Nets
3V3: C20.1 C21.1 C22.1 R25.2 R26.2 R27.2 R28.2 R29.2 S3.3(VDD) S3.28(VDDIO)
GND: C20.2 C21.2 C22.2 C23.1 C24.1 C25.1 R32.1 R33.1 S3.2(GND) S3.5(PS1) S3.6(PS0) S3.15(PIN15) S3.16(PIN16) S3.18(COM2) S3.25(GNDIO)
SCL: R26.1 S3.19(COM1) ; port SCL
SDA: R25.1 S3.20(COM0) ; port SDA
NetC23_2: C23.2 S3.27(XIN32) XT2.2(OSC2)
NetC24_2: C24.2 S3.26(XOUT32) XT2.1(OSC1)
NetC25_2: C25.2 S3.9(CAP)
NetR27_1: R27.1 S3.11(~{RESET}) ; port ~{RST_S}
NetR28_1: R28.1 R32.2 S3.17(COM3)
NetR29_1: R29.1 S3.4(NBOOT_LOAD_PIN)
NetR30_1: R30.1 R31.1 ; port INT_BN
NetR30_2: R30.2 S3.14(INT)
NetR31_2: R31.2 R33.2 S3.10(BL_IND)

Not connected (* = marked no-connect by the designer): S3 1(PIN1)* 7(PIN7)* 8(PIN8)* 12(PIN12)* 13(PIN13)* 21(PIN21)* 22(PIN22)* 23(PIN23)* 24(PIN24)*

### Library data of the parts
C20-C22 C25 = CL10B104KO8NNNC: as C6 on sheet US_SB_GC; Manufacturer Part Number: CL10B104KO8NNNC; Voltage: 16V; Value: 100n; Dielectric: X7R; Supplier 1: Digi-Key; Supplier Part Number 1: 1276-1005-1-ND
C23 C24 = CL10C180JB8NNNC: as C16 on sheet US_SB_MCU; Manufacturer Part Number: CL10C180JB8NNNC; Voltage: 50V; Value: 18p; Dielectric: C0G/NP0; Supplier 1: Digi-Key; Supplier Part Number 1: 1276-1089-1-ND
R25 R26 = CR0603-JW-4.7k: RES SMD 4.7K OHM 5% 1/10W 0603; Manufacturer: Bourns Inc.; Manufacturer Part Number: CR0603-JW-472ELF; Value: 4.7k; Tolarance: ±5%; Supplier 1: Digi-Key; Supplier Part Number 1: CR0603-JW-472ELFCT-ND
R27-R29 R32 = RMCF0603FT10K0: as R19 on sheet US_SB_MCU; Value: 10.0k; Tolarance: 1%; Manufacturer Part Number: RMCF0603FT10K0; Supplier 1: Digi-Key; Supplier Part Number 1: RMCF0603FT10K0CT-ND
R30 R31 R33 = CR0603-J/-000ELF: as R1 on sheet US_SB_BIC; Value: 0R; Manufacturer Part Number: CR0603-J/-000ELF; Supplier 1: Digi-Key; Supplier Part Number 1: CR0603-J/-000ELFCT-ND
S3 = BNO055: Accelerometer, Gyroscope, Magnetometer, 3 Axis Sensor I²C, UART Output; Manufacturer: Bosch Sensortec; Manufacturer Part Number: BNO055; Supplier 1: Digi-Key; Supplier Part Number 1: 828-1058-1-ND
XT2 = FC-135-32.7680K: 32.768kHz ±20ppm Crystal 12.5pF 70 kOhms 2-SMD, No Lead; Manufacturer: EPSON; Manufacturer Part Number: FC-135 32.7680KA-A5; Frequency: 32.768kHz; Tolarance: ±20ppm; Supplier 1: Digi-Key; Supplier Part Number 1: SER4103CT-ND

## Sheet US_SB_OS.SchDoc
size A4
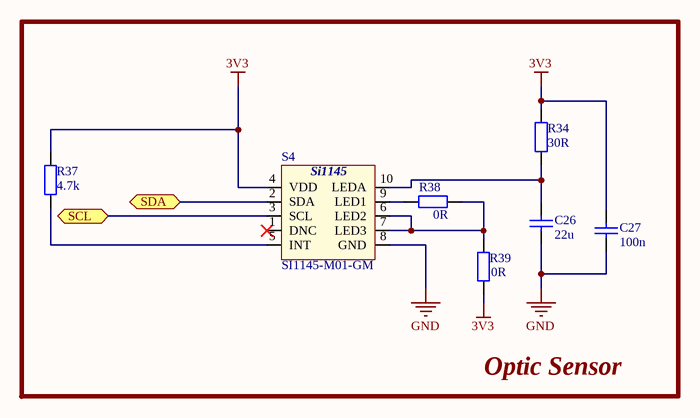
[diagram p6: US_SB_OS.SchDoc]

### Parts
C26  22u  [C0805_IPC_HD]
C27  100n  [C0603_IPC_HD]
R34  30R  [C0603_IPC_HD]
R37  4.7k  [R0603_IPC_HD]
R38  0R  [R0603_IPC_MD]
R39  0R  [R0603_IPC_MD]
S4  SI1145-M01-GM  [Si1145]

### Blocks framed on the sheet
Optic Sensor: C26 C27 R34 R37-R39 S4

### Ports
SCL, SDA

### Nets
3V3: C27.1 R34.1 R37.2 R39.2 S4.4(VDD)
GND: C26.1 C27.2 S4.8(GND)
NetC26_2: C26.2 R34.2 S4.10(LEDA)
NetR37_1: R37.1 S4.5(INT)
NetR38_1: R38.1 R39.1 S4.6(LED2) S4.7(LED3)
NetR38_2: R38.2 S4.9(LED1)
NetS4_2: S4.2(SDA) ; port SDA
NetS4_3: S4.3(SCL) ; port SCL

Not connected (* = marked no-connect by the designer): S4 1(DNC)*

### Library data of the parts
C26 = CL21A226MOCLRNC: CAP CER 22UF 16V X5R 0805; Manufacturer: Samsung Electro-Mechanics; Manufacturer Part Number: CL21A226MOCLRNC; Voltage: 16V; Value: 22u; Dielectric: X5R; Supplier 1: Digi-Key; Supplier Part Number 1: 1276-6780-1-ND
C27 = CL10B104KO8NNNC: as C6 on sheet US_SB_GC; Manufacturer Part Number: CL10B104KO8NNNC; Voltage: 16V; Value: 100n; Dielectric: X7R; Supplier 1: Digi-Key; Supplier Part Number 1: 1276-1005-1-ND
R34 = CR0603-JW-30Ohm: RES SMD 30 OHM 5% 1/10W 0603; Manufacturer: Bourns Inc.; Manufacturer Part Number: CR0603-JW-300ELF; Value: 30R; Tolarance: ±5%; Supplier 1: Digi-Key; Supplier Part Number 1: CR0603-JW-300ELFCT-ND
R37 = CR0603-JW-4.7k: as R25 on sheet US_SB_Orinet; Value: 4.7k; Tolarance: ±5%; Supplier 1: Digi-Key; Supplier Part Number 1: CR0603-JW-472ELFCT-ND
R38 R39 = CR0603-J/-000ELF: as R1 on sheet US_SB_BIC; Value: 0R; Manufacturer Part Number: CR0603-J/-000ELF; Supplier 1: Digi-Key; Supplier Part Number 1: CR0603-J/-000ELFCT-ND
S4 = Si1145: Optical Sensor Ambient, IR, Ultraviolet (UV) 850nm I²C 10-SMD Module, No Lead; Manufacturer: Silicon Labs; Manufacturer Part Number: SI1145-M01-GM; Supplier 1: Digi-Key; Supplier Part Number 1: 336-5135-ND

## Sheet US_SB_RS485.SchDoc
size A4
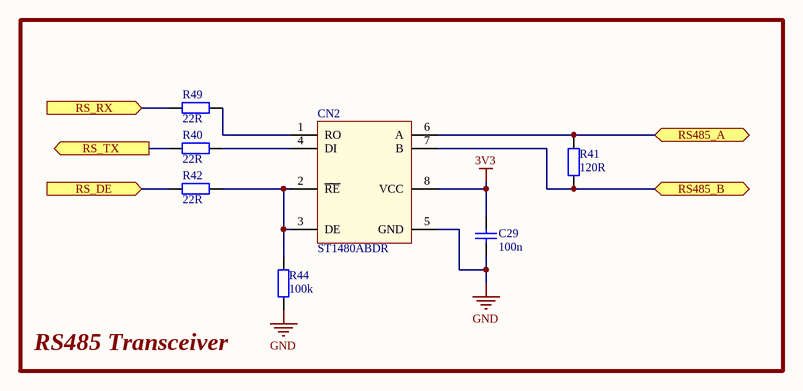
[diagram p7: US_SB_RS485.SchDoc]

### Parts
C29  100n  [C0603_IPC_HD]
CN2  ST1480ABDR  [SOIC-8]
R40  22R  [R0603_IPC_MD]
R41  120R  [R0603_IPC_MD]
R42  22R  [R0603_IPC_MD]
R44  100k  [R0603_IPC_MD]
R49  22R  [R0603_IPC_MD]

### Blocks framed on the sheet
RS485 Transceiver: C29 CN2 R40-R42 R44 R49

### Ports
RS485_A (bidir), RS485_B (bidir), RS_DE (in), RS_RX (in), RS_TX (out)

### Nets
3V3: C29.2 CN2.8(VCC)
GND: C29.1 CN2.5(GND) R44.1
NetCN2_1: CN2.1(RO) R49.2
NetCN2_2: CN2.2(~{RE}) CN2.3(DE) R42.2 R44.2
NetCN2_4: CN2.4(DI) R40.2
NetCN2_6: CN2.6(A) R41.2 ; port RS485_A
NetCN2_7: CN2.7(B) R41.1 ; port RS485_B
NetR40_1: R40.1 ; port RS_TX
NetR42_1: R42.1 ; port RS_DE
NetR49_1: R49.1 ; port RS_RX

### Library data of the parts
C29 = CL10B104KO8NNNC: as C6 on sheet US_SB_GC; Manufacturer Part Number: CL10B104KO8NNNC; Voltage: 16V; Value: 100n; Dielectric: X7R; Supplier 1: Digi-Key; Supplier Part Number 1: 1276-1005-1-ND
CN2 = ST1480ABDR: IC TXRX 3.3V RS485/422 8 SOIC; Manufacturer: STMicroelectronics; Manufacturer Part Number: ST1480ABDR; Supplier 1: Digi-Key; Supplier Part Number 1: 497-2046-1-ND
R40 R42 R49 = CR0603-JW-220ELF: RES SMD 22 OHM 5% 1/10W 0603; Manufacturer: Bourns Inc.; Value: 22R; Tolarance: 5%; Manufacturer Part Number: CR0603-JW-220ELF; Supplier 1: Digi-Key; Supplier Part Number 1: CR0603-JW-220ELFCT-ND
R41 = RC0603JR-07120RL: RES SMD 120 OHM 5% 1/10W 0603; Manufacturer: Yageo; Value: 120R; Tolarance: 5%; Manufacturer Part Number: RC0603JR-07120RL; Supplier 1: Digi-Key; Supplier Part Number 1: 311-120GRCT-ND
R44 = CR0603-JW-104ELF: as R14 on sheet US_SB_GC; Value: 100k; Tolarance: ±1%; Supplier 1: Digi-Key; Supplier Part Number 1: RMCF0603FT100KCT-ND

## Sheet US_SB_USB.SchDoc
size A4
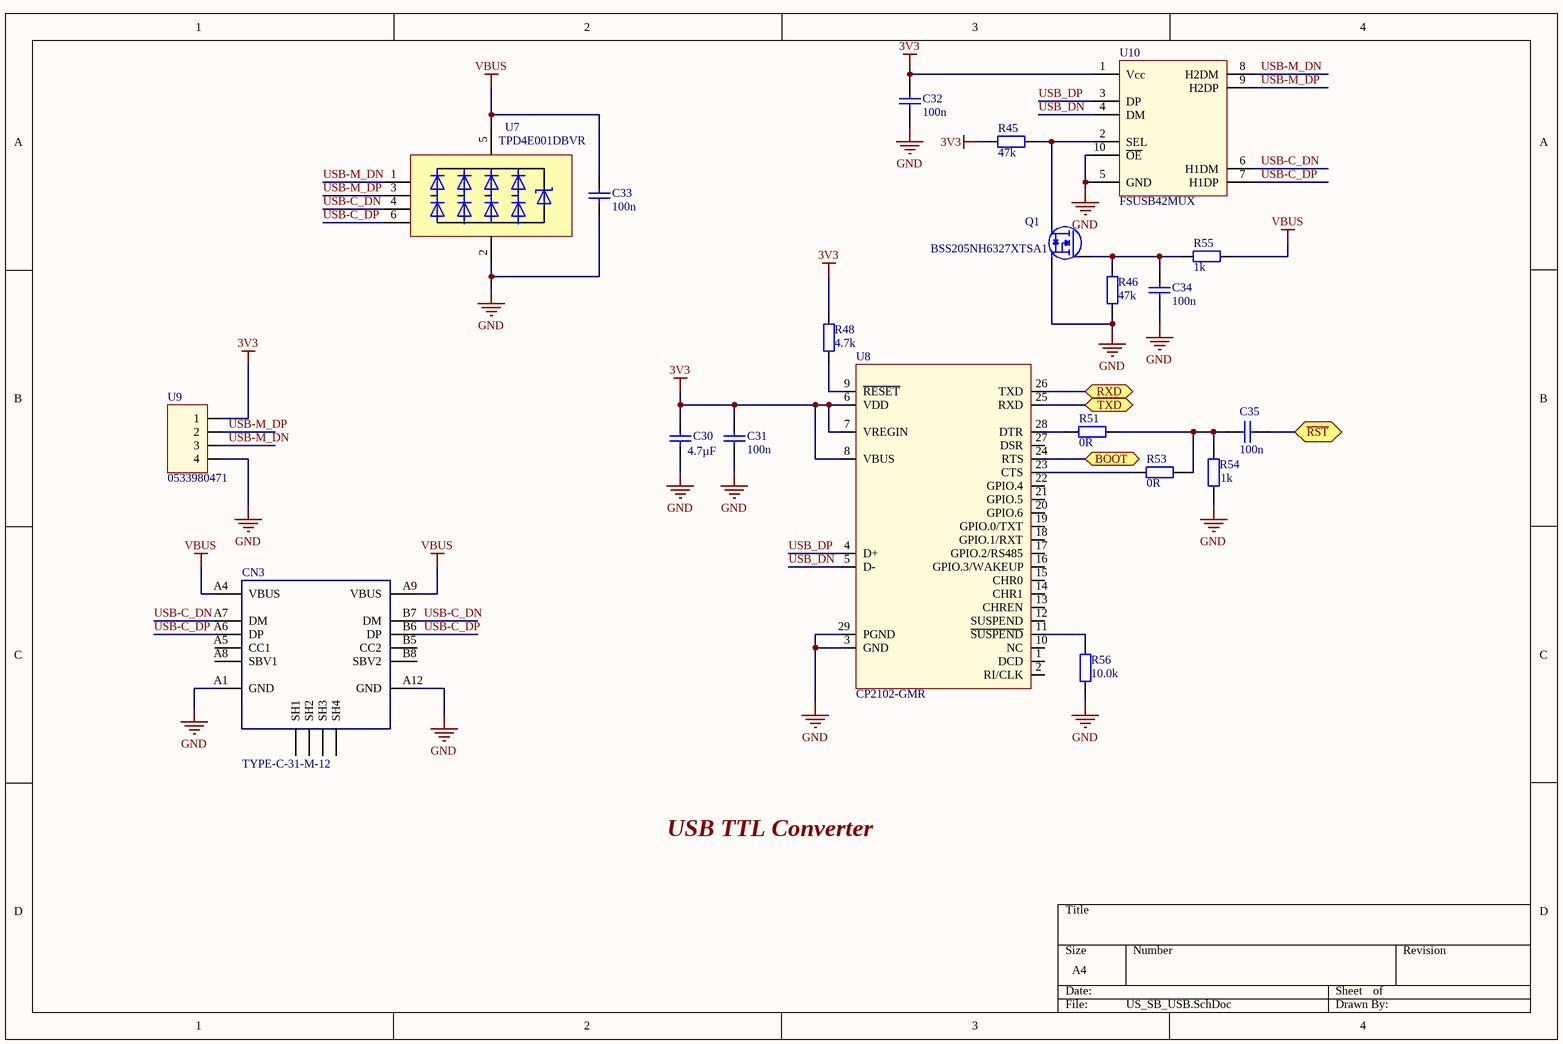
[diagram p8: US_SB_USB.SchDoc]

### Parts
C30  4.7µF  [C0603_IPC_HD]
C31  100n  [C0603_IPC_HD]
C32  100n  [C0603_IPC_HD]
C33  100n  [C0603_IPC_HD]
C34  100n  [C0603_IPC_HD]
C35  100n  [C0603_IPC_HD]
CN3  TYPE-C-31-M-12  [TYPE-C-C165948]
Q1  BSS205NH6327XTSA1
R45  47k  [R0603_IPC_HD]
R46  47k  [R0603_IPC_HD]
R48  4.7k  [R0603_IPC_HD]
R51  0R  [R0603_IPC_MD]
R53  0R  [R0603_IPC_MD]  (no BOM)
R54  1k  [R0603_IPC_MD]
R55  1k  [R0603_IPC_MD]
R56  10.0k  [R0603_IPC_MD]
U7  TPD4E001DBVR  [SOT23-6]
U8  CP2102-GMR  [CP2102\9_QFN50P500X500X80_HS-29N]
U9  0533980471  [PB_53261-0471_Right]
U10  FSUSB42MUX  [MSOP-10]

### Ports
BOOT, RXD, TXD, ~{RST}

### Nets
3V3: C30.2 C31.2 C32.2 R45.2 R48.2 U8.6(VDD) U8.7(VREGIN) U8.8(VBUS) U9.1 U10.1(Vcc)
GND: C30.1 C31.1 C32.1 C33.1 C34.1 CN3.A1(GND) CN3.A12(GND) Q1.2(S) R46.2 R54.1 R56.1 U7.2(GND) U8.3(GND) U8.29(PGND) U9.4 U10.5(GND) U10.10(~{OE})
VBUS: C33.2 CN3.A4(VBUS) CN3.A9(VBUS) R55.1 U7.5(VCC)
USB-C_DN: CN3.A7(DM) CN3.B7(DM) U7.4(IO3) U10.6(H1DM)
USB-C_DP: CN3.A6(DP) CN3.B6(DP) U7.6(IO4) U10.7(H1DP)
USB-M_DN: U7.1(IO1) U9.3 U10.8(H2DM)
USB-M_DP: U7.3(IO2) U9.2 U10.9(H2DP)
USB_DN: U8.5(D-) U10.4(DM)
USB_DP: U8.4(D+) U10.3(DP)
NetC34_2: C34.2 Q1.1(G) R46.1 R55.2
NetC35_1: C35.1 ; port ~{RST}
NetC35_2: C35.2 R51.1 R53.1 R54.2
NetQ1_3: Q1.3(D) R45.1 U10.2(SEL)
NetR48_1: R48.1 U8.9(~{RESET})
NetR51_2: R51.2 U8.28(DTR)
NetR53_2: R53.2 U8.23(CTS)
NetR56_2: R56.2 U8.11(~{SUSPEND})
NetU8_24: U8.24(RTS) ; port BOOT
NetU8_25: U8.25(RXD) ; port TXD
NetU8_26: U8.26(TXD) ; port RXD

Not connected (* = marked no-connect by the designer): CN3 A5(CC1) A8(SBV1) B5(CC2) B8(SBV2) SH1 SH2 SH3 SH4; U8 1(DCD) 2(RI/CLK) 10(NC) 12(SUSPEND) 13(CHREN) 14(CHR1) 15(CHR0) 16(GPIO.3/WAKEUP) 17(GPIO.2/RS485) 18(GPIO.1/RXT) 19(GPIO.0/TXT) 20(GPIO.6) 21(GPIO.5) 22(GPIO.4) 27(DSR)

### Notes on the sheet
- USB TTL Converter

### Library data of the parts
C30 = CL0603_4.7uF_10V: 4.7µF ±10% 10V Ceramic Capacitor X5R 0603 (1608 Metric); Manufacturer: Samsung Electro-Mechanics; Manufacturer Part Number: CL10A475KP8NNNC; Dielectric: X7R; Voltage: 10V; Value: 4.7µF; Supplier 1: Digi-Key; Supplier Part Number 1: 1276-1044-1-ND
C31-C35 = CL10B104KO8NNNC: as C6 on sheet US_SB_GC; Manufacturer Part Number: CL10B104KO8NNNC; Voltage: 16V; Value: 100n; Dielectric: X7R; Supplier 1: Digi-Key; Supplier Part Number 1: 1276-1005-1-ND
CN3 = TYPE-C-31-M-12: TYPE C PCB TH CONN; Manufacturer: Korean Hroparts Elec; Manufacturer Part Number: TYPE-C-31-M-12; Supplier 1: LCSC; Supplier Part Number 1: C165948
Q1 = BSS205NH6327XTSA1: N-Channel 20V 2.5A (Ta) 500mW (Ta) Surface Mount SOT-23-3; Manufacturer: Infineon Technologies; Manufacturer Part Number: BSS205NH6327XTSA1; Supplier 1: Digi-Key; Supplier Part Number 1: BSS205NH6327XTSA1CT-ND
R45 R46 = CR0603-JW-473ELF: as R13 on sheet US_SB_GC; Value: 47k; Tolarance: 5%; Manufacturer Part Number: CR0603-JW-473ELF; Supplier 1: Digi-Key; Supplier Part Number 1: CR0603-JW-473ELFCT-ND
R48 = CR0603-JW-4.7k: as R25 on sheet US_SB_Orinet; Value: 4.7k; Tolarance: ±5%; Supplier 1: Digi-Key; Supplier Part Number 1: CR0603-JW-472ELFCT-ND
R51 R53 = CR0603-J/-000ELF: as R1 on sheet US_SB_BIC; Value: 0R; Manufacturer Part Number: CR0603-J/-000ELF; Supplier 1: Digi-Key; Supplier Part Number 1: CR0603-J/-000ELFCT-ND
R54 R55 = CR0603-JW-102ELF: as R4 on sheet US_SB_GC; Value: 1k; Tolarance: 5%; Manufacturer Part Number: CR0603-JW-102ELF; Supplier 1: Digi-Key; Supplier Part Number 1: CR0603-JW-102ELFCT-ND
R56 = RMCF0603FT10K0: as R19 on sheet US_SB_MCU; Value: 10.0k; Tolarance: 1%; Manufacturer Part Number: RMCF0603FT10K0; Supplier 1: Digi-Key; Supplier Part Number 1: RMCF0603FT10K0CT-ND
U7 = TPD4E001DBVR: as U4 on sheet US_SB_BIC; Manufacturer Part Number: TPD4E001DBVR; Supplier 1: Digi-Key; Supplier Part Number 1: 296-28203-1-ND
U8 = CP2102N-A01-GQFN28R: USB Bridge, USB to UART USB 2.0 UART Interface 28-QFN (5x5); Manufacturer: Silicon Labs; Manufacturer Part Number: CP2102N-A01-GQFN28R; Supplier 1: Digi-Key; Supplier Part Number 1: 336-4738-1-ND
U9 = PB_053398_0471: as U1 on sheet US_SB_BIC; Manufacturer Part Number: 0533980471; Supplier 1: Digi-Key; Supplier Part Number 1: WM7608TR-ND
U10 = FSUSB42MUX: IC USB SWITCH DPDT 10MSOP; Manufacturer: ON Semiconductor; Manufacturer Part Number: FSUSB42MUX; Supplier 1: Digi-Key; Supplier Part Number 1: FSUSB42MUXCT-ND

## Nets that join several sheets
3V3: US_SB_BIC (8 pins), US_SB_GC (6 pins), US_SB_MCU (17 pins), US_SB_Meteo (6 pins), US_SB_Orinet (10 pins), US_SB_OS (5 pins), US_SB_RS485 (C29.2 CN2.8), US_SB_USB (10 pins)
GND: US_SB_BIC (16 pins), US_SB_GC (15 pins), US_SB_MCU (29 pins), US_SB_Meteo (5 pins), US_SB_Orinet (15 pins), US_SB_OS (C26.1 C27.2 S4.8), US_SB_RS485 (C29.1 CN2.5 R44.1), US_SB_USB (17 pins)